# EAGLE design DimmerRGB_RevB (EAGLE 7.6.0)

## Sheet 1 of 2
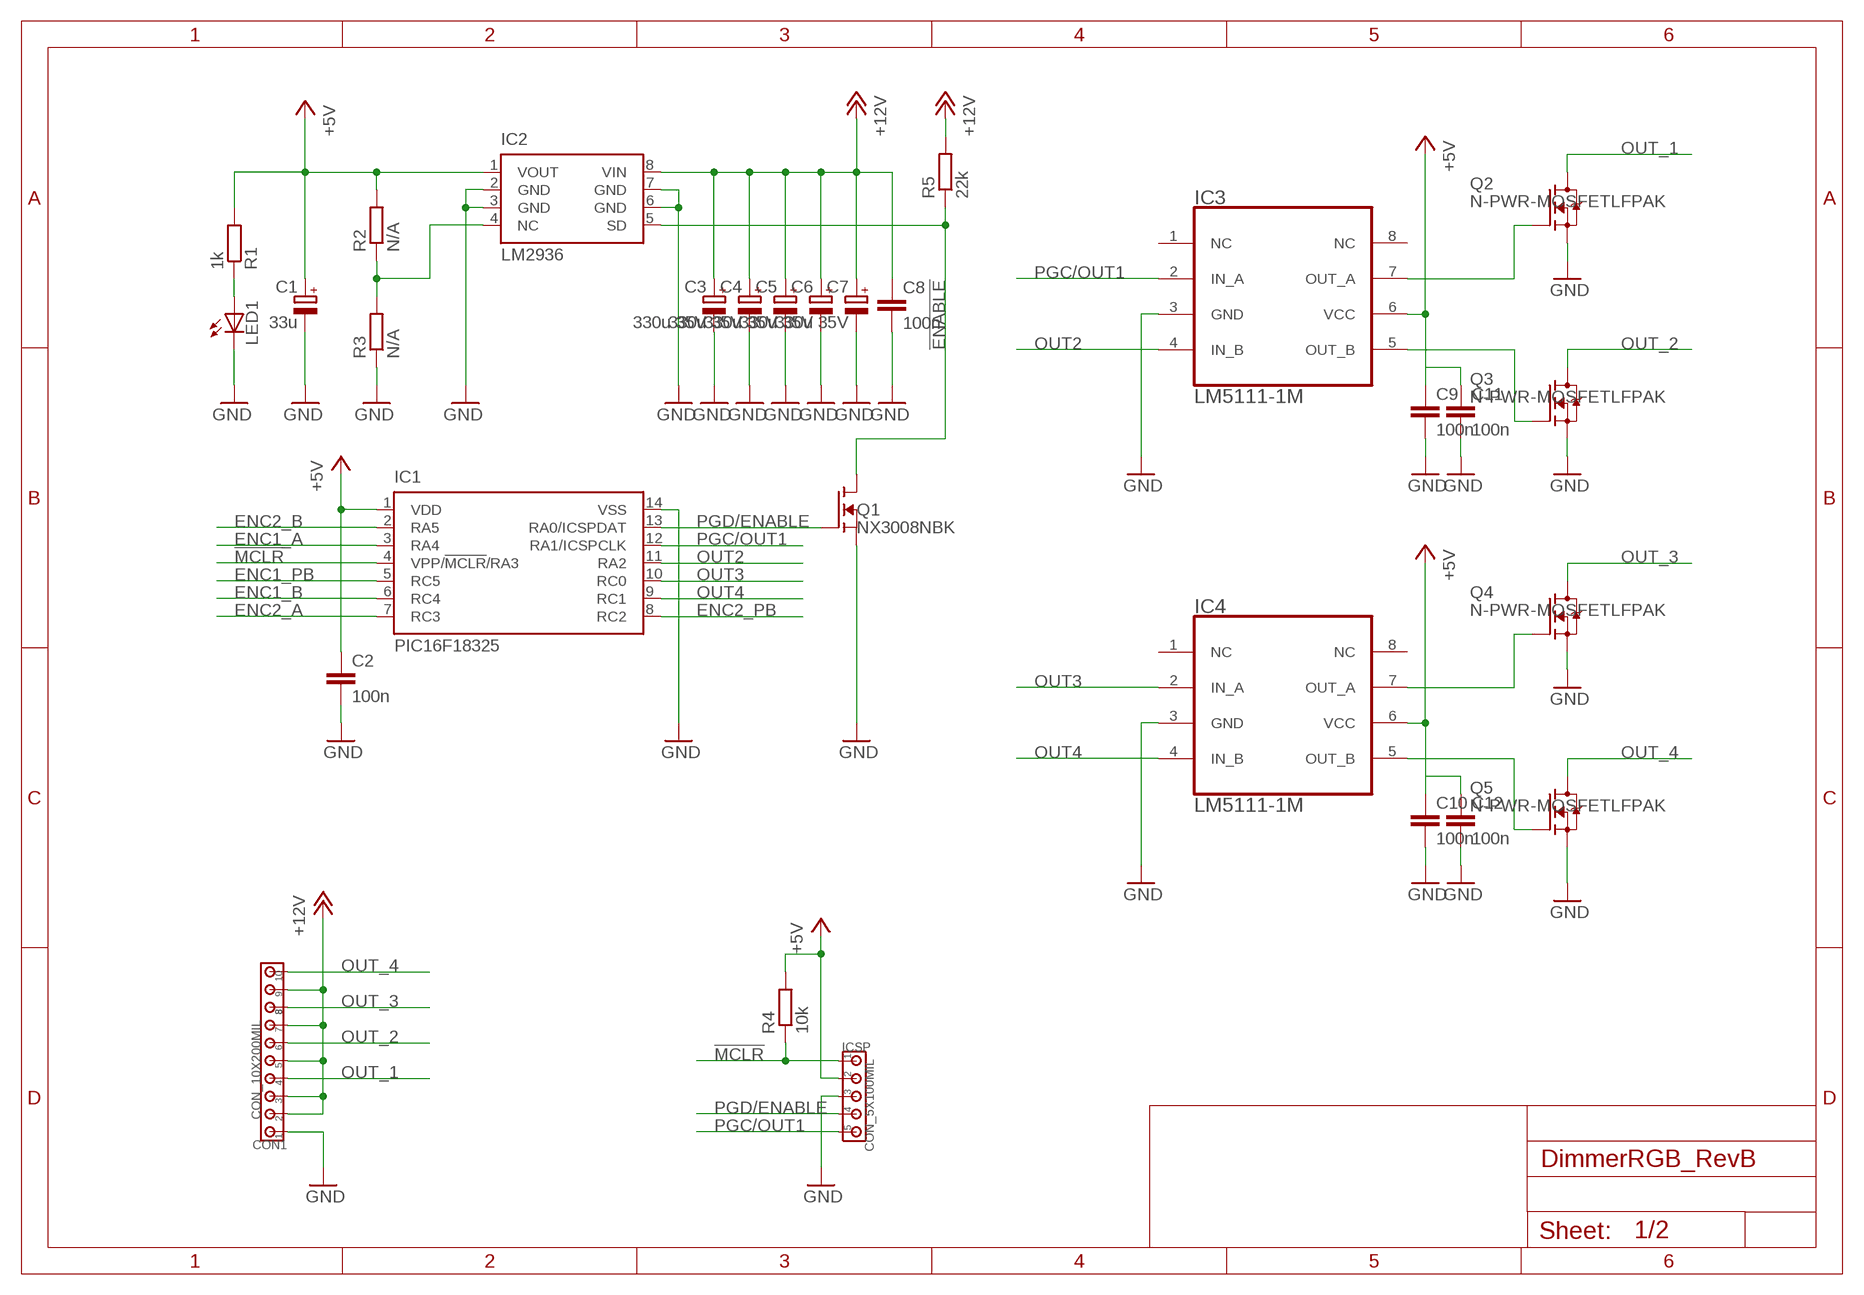
[diagram p0: schematic, sheet 1]

### Parts
C1  33u  C_POLARIZEDSMC_C  [SMC_C]
C2  100n  CC0805  [C0805]
C3  330u 35V  C_POLARIZED10MM  [10MM]
C4  330u 35V  C_POLARIZED10MM  [10MM]
C5  330u 35V  C_POLARIZED10MM  [10MM]
C6  330u 35V  C_POLARIZED10MM  [10MM]
C7  330u 35V  C_POLARIZED10MM  [10MM]
C8  100n  CC0805  [C0805]
C9  100n  CC0805  [C0805]
C10  100n  CC0805  [C0805]
C11  100n  CC0805  [C0805]
C12  100n  CC0805  [C0805]
CON1  CON_10X200MIL  [200MIL_10X]
IC1  PIC16F18325  [SO14]
IC2  LM2936  [SOIC8]
IC3  LM5111-1M  LM5111  [SOIC8]
IC4  LM5111-1M  LM5111  [SOIC8]
ICSP  CON_5X100MIL  [100MIL_5X]
LED1  LED0805  [LED0805]
Q1  NX3008NBK  N-FETSOT23  [SOT23]
Q2  N-PWR-MOSFETLFPAK  [LFPAK]
Q3  N-PWR-MOSFETLFPAK  [LFPAK]
Q4  N-PWR-MOSFETLFPAK  [LFPAK]
Q5  N-PWR-MOSFETLFPAK  [LFPAK]
R1  1k  RESISTORR0805  [R0805]
R2  N/A  RESISTORR0805  [R0805]
R3  N/A  RESISTORR0805  [R0805]
R4  10k  RESISTORR0805  [R0805]
R5  22k  RESISTORR0805  [R0805]

### Nets
!ENABLE!: IC2.5(SD) Q1.3(D) R5.1 ; also sheet 2
!MCLR!: IC1.4(VPP/!MCLR!/RA3) ICSP.1 R4.1
+5V: C1.+ C2.1 C9.1 C10.1 C11.1 C12.1 IC1.1(VDD) IC2.1(VOUT) IC3.6(VCC) IC4.6(VCC) ICSP.2 R1.2 R2.2 R4.2 ; also sheet 2
+12V: C3.+ C4.+ C5.+ C6.+ C7.+ C8.1 CON1.2 CON1.3 CON1.5 CON1.7 CON1.9 IC2.8(VIN) R5.2
ENC1_A: IC1.3(RA4) ; also sheet 2
ENC1_B: IC1.6(RC4) ; also sheet 2
ENC1_PB: IC1.5(RC5) ; also sheet 2
ENC2_A: IC1.7(RC3) ; also sheet 2
ENC2_B: IC1.2(RA5) ; also sheet 2
ENC2_PB: IC1.8(RC2) ; also sheet 2
GND: C1.- C2.2 C3.- C4.- C5.- C6.- C7.- C8.2 C9.2 C10.2 C11.2 C12.2 CON1.1 IC1.14(VSS) IC2.2(GND) IC2.3(GND) IC2.6(GND) IC2.7(GND) IC3.3(GND) IC4.3(GND) ICSP.3 LED1.C Q1.2(S) Q2.1(S) Q2.2(S) Q2.3(S) Q3.1(S) Q3.2(S) Q3.3(S) Q4.1(S) Q4.2(S) Q4.3(S) Q5.1(S) Q5.2(S) Q5.3(S) R3.1 ; also sheet 2
N$1: IC4.5(OUT_B) Q5.4(G)
N$2: LED1.A R1.1
N$5: IC3.7(OUT_A) Q2.4(G)
N$6: IC4.7(OUT_A) Q4.4(G)
N$8: IC2.4(NC) R2.1 R3.2
N$11: IC3.5(OUT_B) Q3.4(G)
OUT2: IC1.11(RA2) IC3.4(IN_B)
OUT3: IC1.10(RC0) IC4.2(IN_A)
OUT4: IC1.9(RC1) IC4.4(IN_B)
OUT_1: CON1.4 Q2.MB1(D) Q2.MB2(D) Q2.MB3(D) Q2.VIA1(D) Q2.VIA2(D) Q2.VIA3(D) Q2.VIA4(D) Q2.VIA5(D) Q2.VIA6(D) Q2.VIA7(D) Q2.VIA8(D) Q2.VIA9(D)
OUT_2: CON1.6 Q3.MB1(D) Q3.MB2(D) Q3.MB3(D) Q3.VIA1(D) Q3.VIA2(D) Q3.VIA3(D) Q3.VIA4(D) Q3.VIA5(D) Q3.VIA6(D) Q3.VIA7(D) Q3.VIA8(D) Q3.VIA9(D)
OUT_3: CON1.8 Q4.MB1(D) Q4.MB2(D) Q4.MB3(D) Q4.VIA1(D) Q4.VIA2(D) Q4.VIA3(D) Q4.VIA4(D) Q4.VIA5(D) Q4.VIA6(D) Q4.VIA7(D) Q4.VIA8(D) Q4.VIA9(D)
OUT_4: CON1.10 Q5.MB1(D) Q5.MB2(D) Q5.MB3(D) Q5.VIA1(D) Q5.VIA2(D) Q5.VIA3(D) Q5.VIA4(D) Q5.VIA5(D) Q5.VIA6(D) Q5.VIA7(D) Q5.VIA8(D) Q5.VIA9(D)
PGC/OUT1: IC1.12(RA1/ICSPCLK) IC3.2(IN_A) ICSP.5
PGD/ENABLE: IC1.13(RA0/ICSPDAT) ICSP.4 Q1.1(G)
Unconnected: IC3.1(NC) IC3.8(NC) IC4.1(NC) IC4.8(NC)

## Sheet 2 of 2
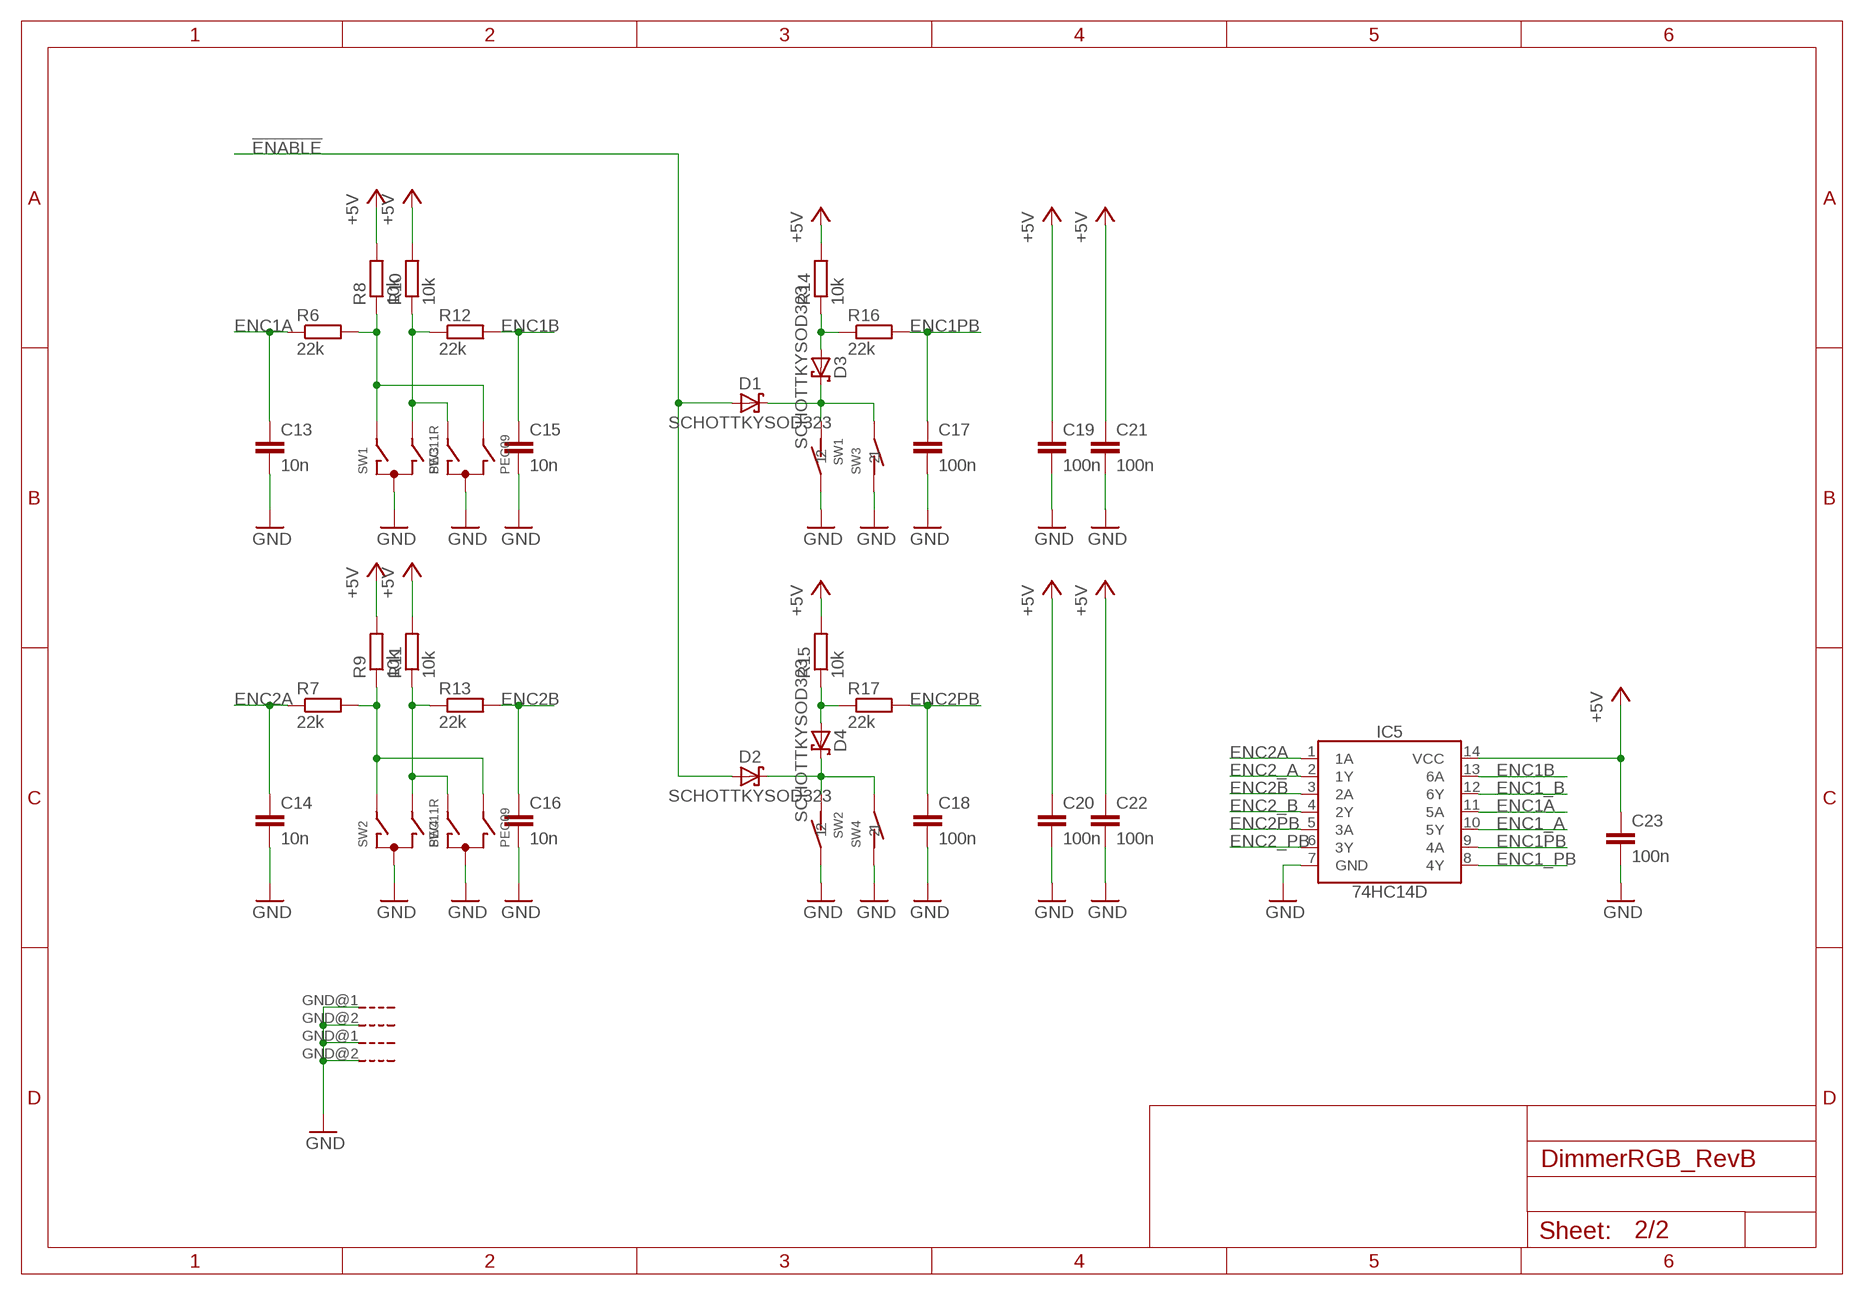
[diagram p1: schematic, sheet 2]

### Parts
C13  10n  CC0805  [C0805]
C14  10n  CC0805  [C0805]
C15  10n  CC0805  [C0805]
C16  10n  CC0805  [C0805]
C17  100n  CC0805  [C0805]
C18  100n  CC0805  [C0805]
C19  100n  CC0805  [C0805]
C20  100n  CC0805  [C0805]
C21  100n  CC0805  [C0805]
C22  100n  CC0805  [C0805]
C23  100n  CC0805  [C0805]
D1  SCHOTTKYSOD323  [SOD323]
D2  SCHOTTKYSOD323  [SOD323]
D3  SCHOTTKYSOD323  [SOD323]
D4  SCHOTTKYSOD323  [SOD323]
IC5  74HC14D  [SO14]
R6  22k  RESISTORR0805  [R0805]
R7  22k  RESISTORR0805  [R0805]
R8  10k  RESISTORR0805  [R0805]
R9  10k  RESISTORR0805  [R0805]
R10  10k  RESISTORR0805  [R0805]
R11  10k  RESISTORR0805  [R0805]
R12  22k  RESISTORR0805  [R0805]
R13  22k  RESISTORR0805  [R0805]
R14  10k  RESISTORR0805  [R0805]
R15  10k  RESISTORR0805  [R0805]
R16  22k  RESISTORR0805  [R0805]
R17  22k  RESISTORR0805  [R0805]
SW1  PEC11R  ENCODER_BOURNS  [ENCODER_BOURNS]
SW2  PEC11R  ENCODER_BOURNS  [ENCODER_BOURNS]
SW3  PEC09  [PEC09]
SW4  PEC09  [PEC09]

### Nets
!ENABLE!: D1.A D2.A ; also sheet 1
+5V: C19.1 C20.1 C21.1 C22.1 C23.1 IC5.14(VCC) R8.2 R9.2 R10.2 R11.2 R14.2 R15.2 ; also sheet 1
ENC1_A: IC5.10(5Y) ; also sheet 1
ENC1_B: IC5.12(6Y) ; also sheet 1
ENC1_PB: IC5.8(4Y) ; also sheet 1
ENC1A: C13.1 IC5.11(5A) R6.1
ENC1B: C15.1 IC5.13(6A) R12.2
ENC1PB: C17.1 IC5.9(4A) R16.2
ENC2_A: IC5.2(1Y) ; also sheet 1
ENC2_B: IC5.4(2Y) ; also sheet 1
ENC2_PB: IC5.6(3Y) ; also sheet 1
ENC2A: C14.1 IC5.1(1A) R7.1
ENC2B: C16.1 IC5.3(2A) R13.2
ENC2PB: C18.1 IC5.5(3A) R17.2
GND: C13.2 C14.2 C15.2 C16.2 C17.2 C18.2 C19.2 C20.2 C21.2 C22.2 C23.2 IC5.7(GND) SW1.2 SW1.C SW1.GND@1(G) SW1.GND@2(G) SW2.2 SW2.C SW2.GND@1(G) SW2.GND@2(G) SW3.C SW3.D SW4.C SW4.D ; also sheet 1
N$12: D2.C D4.C SW2.1 SW4.E
N$13: R10.1 R12.1 SW1.B SW3.A
N$14: R6.2 R8.1 SW1.A SW3.B
N$15: D3.A R14.1 R16.1
N$17: R7.2 R9.1 SW2.A SW4.B
N$18: D4.A R15.1 R17.1
N$19: D1.C D3.C SW1.1 SW3.E
N$20: R11.1 R13.1 SW2.B SW4.A

## Library data of the parts
C1 C3-C7 = 00Capacitor:C_POLARIZED
C2 C8-C23 = 00Capacitor:C: Capacitor
CON1 = 00Connector:CON_10X: 10-pin header
D1-D4 = 00Diode:SCHOTTKY
IC1 = 00PIC:PIC16F18325
IC2 = 00VoltageRegulator:LM2936: Ultra-Low Quiescent Current LDO Voltage Regulator
IC3 IC4 = 00Logic:LM5111: Dual 5A Compound Gate Driver
IC5 = 00Logic:74HC14: Hex Inverter Schmitt Trigger
ICSP = 00Connector:CON_5X: 5-pin header
LED1 = 00Display:LED: LED
Q1 = 00Mosfet:N-FET: N-Channel MOSFET
Q2-Q5 = 00Mosfet:N-PWR-MOSFET
R1-R17 = 00Resistor:RESISTOR: RESISTOR, European symbol
SW1 SW2 = 00Switch:ENCODER_BOURNS: Bourns Rotary Encoder with Switch PEC11-4xxxF-Sxxxx
SW3 SW4 = 00Switch:PEC09

## Board
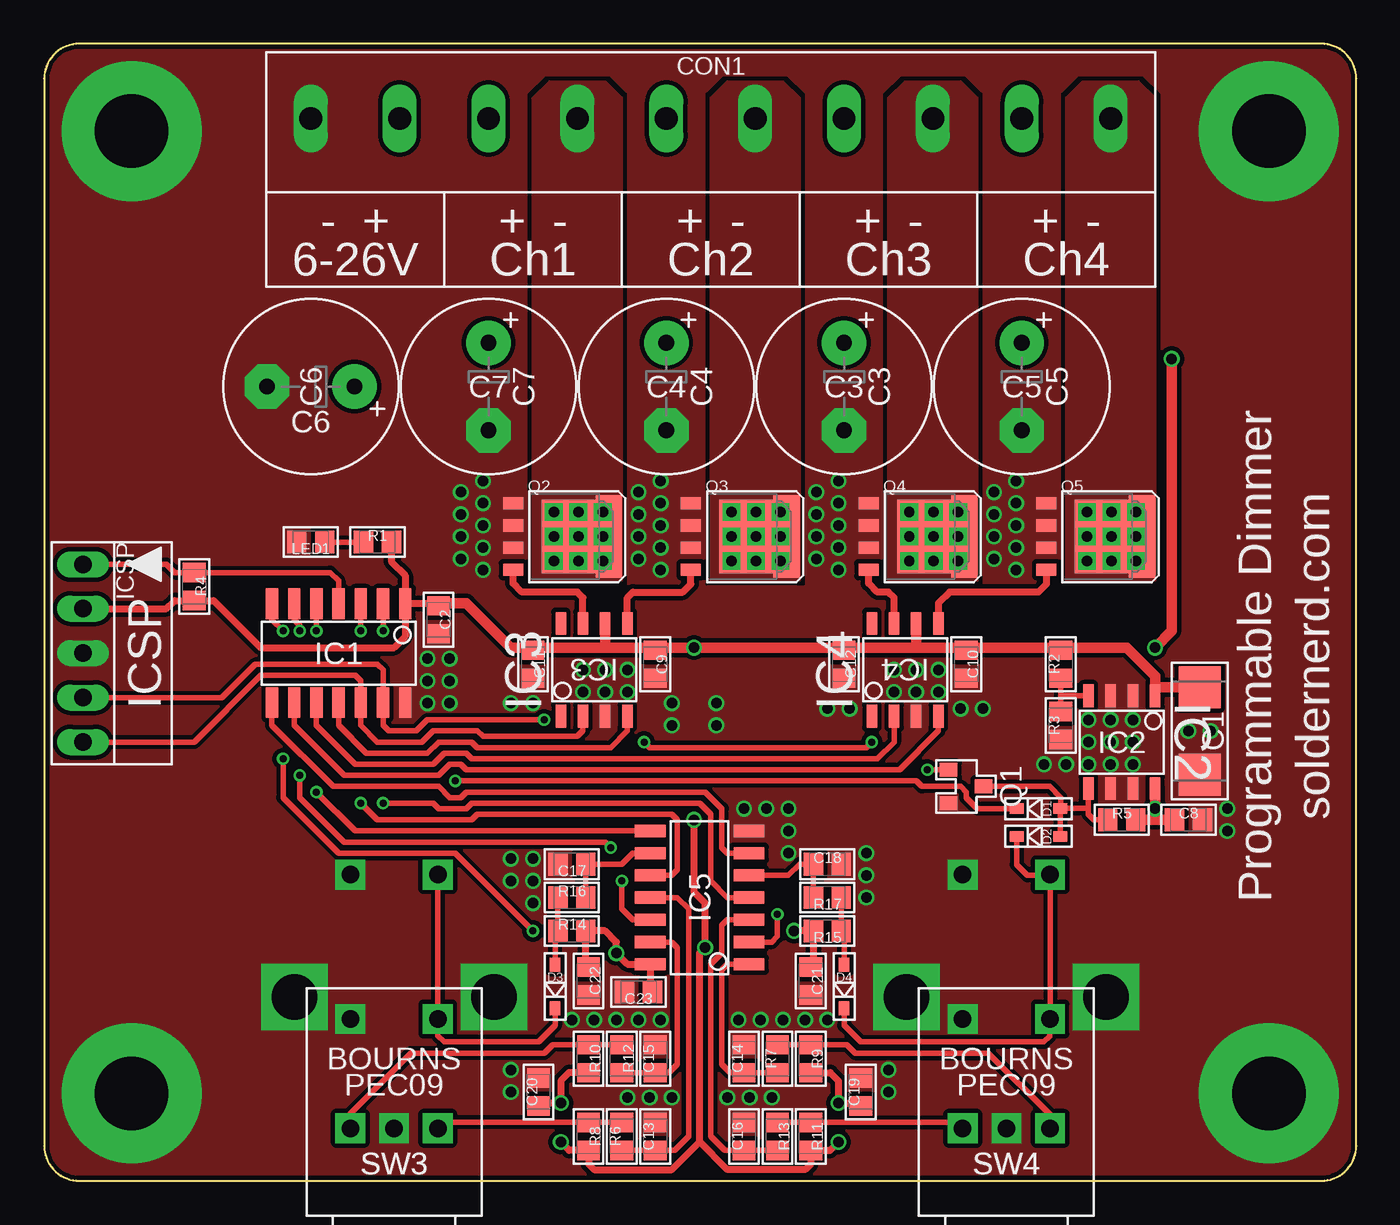
[diagram p2: board, top side]
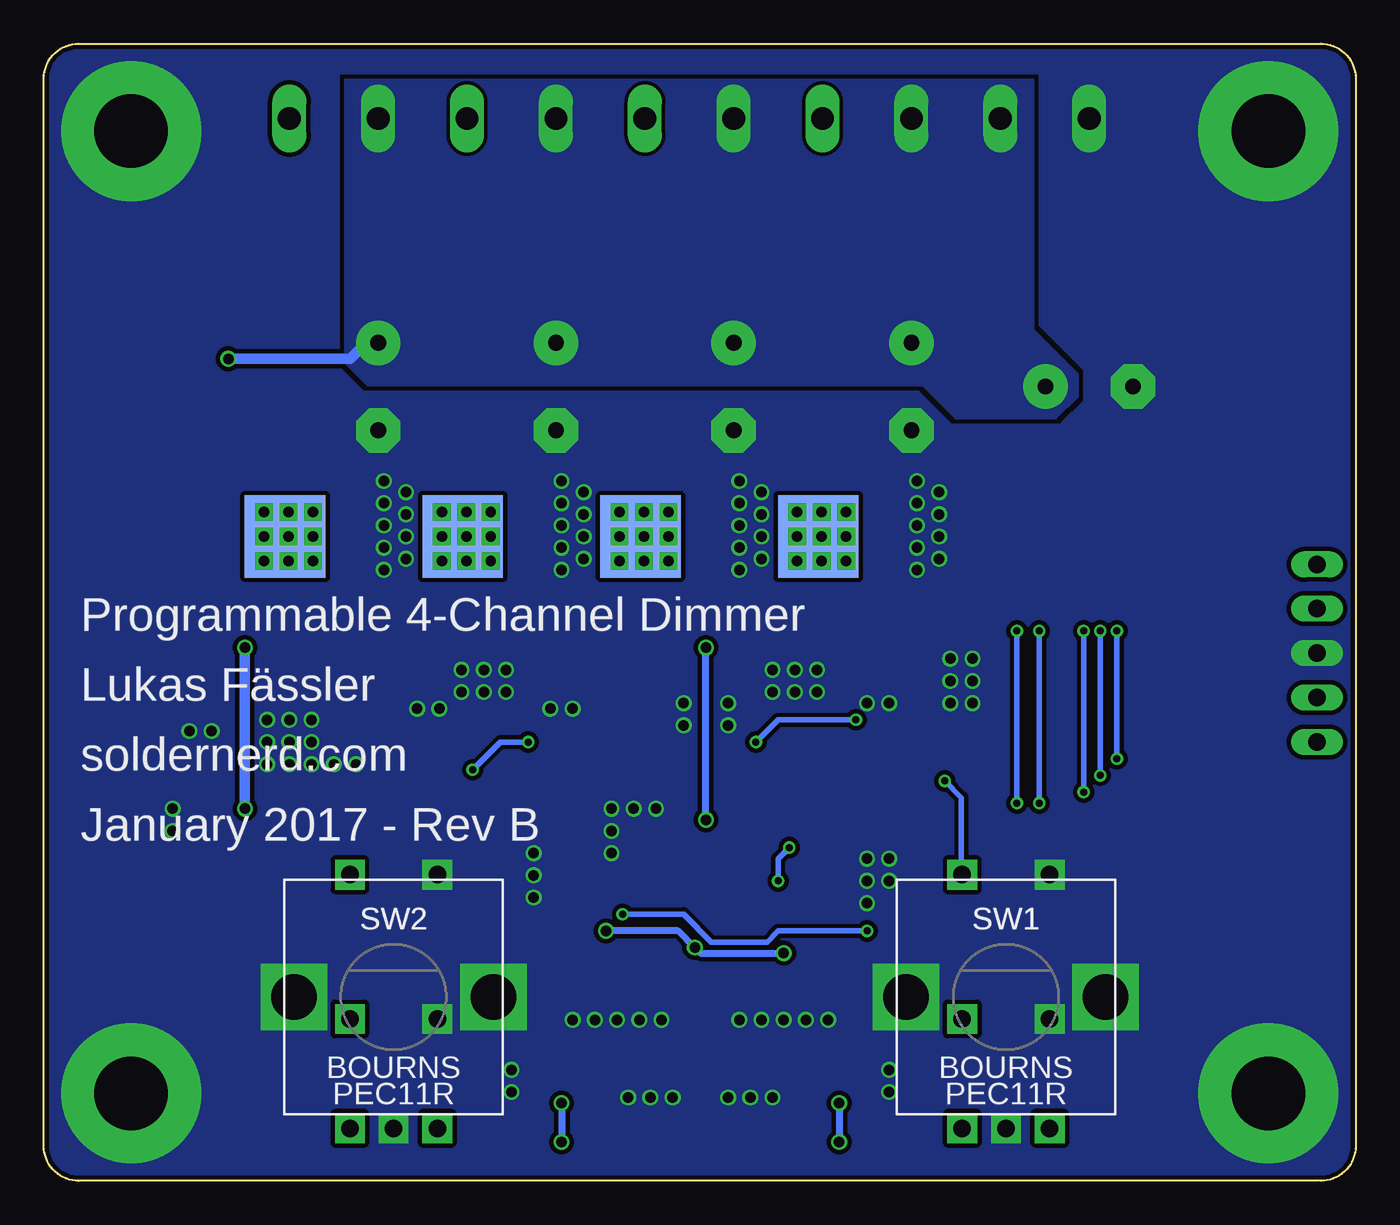
[diagram p3: board, bottom side, seen from below]

Size 75 x 65 mm. Coordinates in mm from the lower left corner, seen from the top.
Outline: 73,0 arc90 75,2 75,63 arc90 73,65 2,65 arc90 0,63 0,2 arc90 2,0 73,0
Copper layers (1*16): Top 0.035mm / dielectric 1.5mm / Bottom 0.035mm
Design rules "dirt_cheap_dirty_boards.8mil": minimum track width 5mil, minimum drill 12mil, track to track 8mil, track to pad 8mil, pad to pad 8mil, via to via 8mil, smd to smd 0mil, copper to edge 10mil, drill to drill 10mil, minimum pad ring 8mil, minimum via ring 6mil, stop-mask expansion 2mil, vias tented up to drill 25mil, thermal gap 10mil

### Footprints (pad centres in the part's own frame; a part is rotated, then mirrored left to right if it is on the bottom)
SMC_C = smd 2.4 x 2.4: + -2.5,0; - 2.5,0
C0805 = smd 1.1 x 1.3: 1 -0.8,0; 2 0.8,0
10MM = drill 0.9 pad 2.54: + -2.5,0 | drill 0.9 pad 2.54 octagon: - 2.5,0
200MIL_10X = drill 1.3 long: 1 -22.86,0; 2 -17.78,0; 3 -12.7,0; 4 -7.62,0; 5 -2.54,0; 6 2.54,0; 7 7.62,0; 8 12.7,0; 9 17.78,0; 10 22.86,0
SOD323 = smd 0.8 x 0.6: A 1.25,0; C -1.25,0
SO14 = smd 0.7 x 1.75: 1 -3.81,-2.825; 2 -2.54,-2.825; 3 -1.27,-2.825; 4 0,-2.825; 5 1.27,-2.825; 6 2.54,-2.825; 7 3.81,-2.825; 8 3.81,2.825; 9 2.54,2.825; 10 1.27,2.825; 11 0,2.825; 12 -1.27,2.825; 13 -2.54,2.825; 14 -3.81,2.825
SOIC8 = smd 1.3 x 0.6: 1 -2.65,1.905; 2 -2.65,0.635; 3 -2.65,-0.635; 4 -2.65,-1.905; 5 2.65,-1.905; 6 2.65,-0.635; 7 2.65,0.635; 8 2.65,1.905
100MIL_5X = drill 1 long: 1 -5.08,0; 2 -2.54,0; 3 0,0; 4 2.54,0; 5 5.08,0
LED0805 = smd 1.1 x 1.3: A -0.8,0; C 0.8,0
SOT23 = smd 0.8 x 1: 1 -0.95,-1; 2 0.95,-1; 3 0,1
LFPAK = smd 0.7 x 1.15: 1 -1.905,-2.725; 2 -0.635,-2.725; 3 0.635,-2.725; 4 1.905,-2.725 | smd 4.2 x 3.1: MB1 0,0.45 | smd 4.7 x 1.5: MB2 0,2.75 | smd 4.7 x 4.6 bottom: MB3 0,1.2 | drill 0.6 square: VIA1 -1.4,2.4; VIA2 0,2.4; VIA3 1.4,2.4; VIA4 -1.4,1; VIA5 0,1; VIA6 1.4,1; VIA7 -1.4,-0.4; VIA8 0,-0.4; VIA9 1.4,-0.4
R0805 = smd 1.1 x 1.3: 1 -0.8,0; 2 0.8,0
ENCODER_BOURNS = drill 1 pad 1.7 square: 1 -2.5,7; 2 2.5,7; A -2.5,-7.5; B 2.5,-7.5; C 0,-7.5 | drill 2.6 pad 3.8 square: GND@1 -5.7,0; GND@2 5.7,0
PEC09 = drill 1 pad 1.7 square: A -2.5,0; B 2.5,0; C 0,0; D -2.5,6.25; E 2.5,6.25

### Placement (x,y rotation side)
C1  66.04,25.72 270 top
C2  22.54,32.07 270 top
C3  45.72,45.4 270 top
C4  35.56,45.4 270 top
C5  55.88,45.4 270 top
C6  15.24,45.4 180 top
C7  25.4,45.4 270 top
C8  65.41,20.64 0 top
C9  34.92,29.53 270 top
C10  52.7,29.53 270 top
C11  27.94,29.53 270 top
C12  45.72,29.53 270 top
C13  34.92,2.54 90 top
C14  40.01,6.99 90 top
C15  34.92,6.99 90 top
C16  40.01,2.54 90 top
C17  30.16,18.1 180 top
C18  44.77,18.1 0 top
C19  46.67,5.08 90 top
C20  28.26,5.08 90 top
C21  43.81,11.43 270 top
C22  31.11,11.43 270 top
C23  33.97,10.79 180 top
CON1  38.1,60.72 0 top
D1  56.83,21.27 0 top
D2  56.83,19.68 0 top
D3  29.21,11.11 90 top
D4  45.72,11.11 90 top
IC1  16.83,30.16 180 top
IC2  61.59,25.08 270 top
IC3  31.43,29.21 90 top
IC4  49.21,29.21 90 top
IC5  37.47,16.19 90 top
ICSP  2.22,30.16 270 top
LED1  15.24,36.51 180 top
Q1  52.7,22.54 270 top
Q2  29.53,36.83 270 top
Q3  39.69,36.83 270 top
Q4  49.85,36.83 270 top
Q5  60.01,36.83 270 top
R1  19.05,36.51 0 top
R2  58.1,29.53 90 top
R3  58.1,26.04 90 top
R4  8.57,33.97 270 top
R5  61.59,20.64 0 top
R6  33.02,2.54 90 top
R7  41.91,6.99 90 top
R8  31.11,2.54 270 top
R9  43.81,6.99 270 top
R10  31.11,6.99 270 top
R11  43.81,2.54 270 top
R12  33.02,6.99 270 top
R13  41.91,2.54 270 top
R14  30.16,14.29 0 top
R15  44.77,14.29 180 top
R16  30.16,16.19 0 top
R17  44.77,16.19 180 top
SW1  20,10.5 0 bottom
SW2  55,10.5 0 bottom
SW3  20,3 0 top
SW4  55,3 0 top

### Tracks (layer width: path | path; a pad name or v marks a point on that pad's centre or on a via)
!ENABLE!
  Top 0.305: D2.A D1.A 58.1,21.29 | Q1.3 57.47,22.54 58.1,21.91 58.1,21.29 | R5.1 60.01,20.64 59.69,20.95 59.69,21.27 | 59.69,21.27 IC2.5 | 58.1,21.29 59.67,21.29 59.69,21.27
!MCLR!
  Top 0.305: ICSP.1 6.99,35.24 7.46,34.77 R4.1 16.34,34.77 16.83,34.29 IC1.4
+5V  (via drill 0.6)
  Top 0.305: 34.55,12.38 IC5.14
  Top 0.406: v45.4,2.22 44.92,1.74 R11.2 43.81,0.95 43.5,0.64 39.05,0.64 37.47,2.22 | R9.2 44.93,6.18 45.4,5.71 v45.4,4.45 46.51,4.45 C19.1 | 37.47,2.22 35.88,0.64 31.43,0.64 31.11,0.95 R8.2 30.01,1.74 v29.53,2.22 | R10.2 30,6.18 29.53,5.71 v29.53,4.45 28.42,4.45 C20.1 | 37.47,2.22 37.47,13.02 v37.78,13.34 37.78,15.88 37.15,16.51 v37.15,20.64 | ICSP.2 6.99,32.7 7.46,33.17 R4.2 9.69,33.17 12.38,30.48 20,30.48 20.64,31.11 IC1.1 | C2.1 22.42,32.99 IC1.1 | v42.86,14.29 R15.2 43.97,12.38 C21.1 | R1.2 19.85,35.4 20.64,34.61 IC1.1 | C22.1 30.96,12.38 R14.2 32.07,14.29 32.7,13.65 v32.7,13.02 33.34,12.38 IC5.14 34.64,10.93 C23.1 | C11.1 27.94,30.48 | C12.1 45.72,30.48
  Top 0.61: 66.04,28.26 C1.+ 63.54,28.22 63.5,28.26 | 52.86,30.48 58.1,30.48 | 52.86,30.48 49.85,30.48 | 49.85,30.48 45.72,30.48 v37.15,30.48 34.92,30.48 | 34.92,30.48 32.07,30.48 | 32.07,30.48 27.94,30.48 26.67,30.48 24.13,33.02 22.7,33.02 C2.1 | IC3.6 32.07,30.48 | C9.1 34.92,30.48 | IC4.6 49.85,30.48 | 52.86,30.48 C10.1 | IC2.1 63.5,28.26 | 63.5,28.26 63.5,28.85 61.87,30.48 58.1,30.48 | R2.2 58.1,30.48
  Bottom 0.406: v45.4,4.45 v45.4,2.22 | v29.53,4.45 v29.53,2.22 | v32.7,13.02 37.47,13.02 v37.78,13.34 38.73,14.29 v42.86,14.29 | v37.15,20.64 v37.15,30.48
+12V  (via drill 0.6)
  Top 0.61: IC2.8 v63.5,21.27 63.5,20.64 | 63.5,20.64 R5.2 | C8.1 63.5,20.64 | v64.45,46.99 64.45,31.43 v63.5,30.48
  Bottom 0.61: C5.+ 56.55,47.9 57.47,46.99 v64.45,46.99 | v63.5,30.48 v63.5,21.27
  pour Bottom (no thermals): 57.78,62.95 57.78,46.75 56.52,45.48 24.77,45.48 22.86,43.58 17.14,43.58 15.88,44.85 15.88,46.12 18.41,48.66 18.41,62.95
ENC1_A  (via drill 0.4)
  Top 0.305: IC5.10 35.88,17.46 36.2,17.78 36.2,20.64 35.88,20.95 24.77,20.95 24.45,20.64 19.05,20.64 v18.1,21.59 | IC1.3 v18.1,31.43
  Bottom 0.305: v18.1,31.43 v18.1,21.59
ENC1_B  (via drill 0.4)
  Top 0.305: IC5.12 33.66,14.92 33.02,15.56 v33.02,17.14 | IC1.6 14.29,32.07 14.61,31.75 v14.61,31.43 | v32.38,19.05 32.07,19.37 17.14,19.37 14.61,21.91 v14.61,23.18
  Bottom 0.305: v14.61,31.43 v14.61,23.18 | v33.02,17.14 33.02,18.41 v32.38,19.05
ENC1_PB  (via drill 0.4)
  Top 0.305: IC1.5 v15.56,31.43 | IC5.8 17.78,20 v15.56,22.23
  Bottom 0.305: v15.56,31.43 v15.56,22.23
ENC1A
  Top 0.305: R6.1 C13.1 36.03,1.74 36.83,2.54 36.83,15.56 36.2,16.19 IC5.11
ENC1B
  Top 0.305: R12.2 C15.1 35.71,6.18 36.2,6.67 36.2,13.34 35.88,13.65 IC5.13
ENC1PB
  Top 0.305: R16.2 C17.1 33.02,18.1 33.66,18.73 IC5.9
ENC2_A  (via drill 0.4)
  Top 0.305: IC1.7 13.02,32.07 v13.65,31.43 | IC5.2 41.59,13.65 41.91,13.97 v41.91,15.24 | v13.65,24.13 13.65,21.91 16.83,18.73 23.5,18.73 v27.94,14.29
  Bottom 0.305: v13.65,31.43 v13.65,24.13 | v41.91,15.24 38.42,15.24 36.83,13.65 33.66,13.65 33.02,14.29 v27.94,14.29
ENC2_B  (via drill 0.4)
  Top 0.305: IC5.4 39.05,16.19 38.1,17.14 38.1,20.95 37.47,21.59 24.45,21.59 24.13,21.27 22.54,21.27 22.23,21.59 v19.37,21.59 | IC1.2 v19.37,31.43
  Bottom 0.305: v19.37,31.43 v19.37,21.59
ENC2_PB
  Top 0.305: IC1.8 13.02,26.04 16.51,22.54 22.54,22.54 23.18,21.91 23.81,21.91 24.13,22.23 37.78,22.23 38.73,21.27 38.73,19.05 39.05,18.73 IC5.6
ENC2A
  Top 0.305: R7.1 C14.1 39.22,6.18 38.73,6.67 38.73,12.06 39.05,12.38 IC5.1
ENC2B
  Top 0.305: R13.2 C16.1 38.9,1.74 38.1,2.54 38.1,12.38 38.73,13.02 38.73,14.61 39.05,14.92 IC5.3
ENC2PB
  Top 0.305: R17.2 C18.1 43.18,18.1 42.55,17.46 IC5.5
GND  (via drill 0.6, 4.2 pad 8)
  other vias: 5,5 70,5 5,60 70,60 21.91,28.57 25.08,40.01 25.08,38.73 25.08,37.47 25.08,36.2 25.08,34.92 35.24,34.92 35.24,36.2 35.24,37.47 35.24,38.73 35.24,40.01 45.4,34.92 45.4,36.2 45.4,37.47 45.4,38.73 45.4,40.01 55.56,34.92 55.56,36.2 55.56,37.47 55.56,38.73 55.56,40.01 33.97,9.21 35.24,9.21 35.88,4.76 39.69,9.21 40.96,9.21 39.05,4.76 34.61,4.76 40.32,4.76 27.94,18.41 27.94,17.14 46.99,17.46 46.99,18.73 30.16,9.21 31.43,9.21 42.55,18.73 48.26,5.08 42.55,20 46.99,16.19 42.23,9.21 32.7,9.21 27.94,15.88 26.67,18.41 41.59,4.76 33.34,4.76 30.8,29.21 32.07,29.21 33.34,29.21 33.34,27.94 32.07,27.94 30.8,27.94 35.88,27.3 35.88,26.04 48.58,27.94 48.58,29.21 49.85,29.21 49.85,27.94 51.12,27.94 51.12,29.21 52.39,26.99 53.66,26.99 21.91,29.84 23.18,28.57 23.18,29.84 23.18,27.3 38.42,27.3 38.42,26.04 21.91,27.3 62.23,26.35 62.23,25.08 62.23,23.81 60.96,23.81 60.96,25.08 60.96,26.35 59.69,23.81 59.69,25.08 59.69,26.35 58.42,23.81 57.15,23.81 67.63,20 66.67,25.72 65.41,25.72 67.63,21.27 48.26,6.35 42.55,21.27 26.67,6.35 26.67,5.08 40.01,21.27 41.27,21.27 26.67,17.14 23.81,39.37 23.81,38.1 23.81,36.83 23.81,35.56 33.97,35.56 33.97,36.83 33.97,38.1 33.97,39.37 44.13,39.37 44.13,38.1 44.13,36.83 44.13,35.56 54.29,39.37 54.29,38.1 54.29,36.83 54.29,35.56 44.77,9.21 43.5,9.21 27.94,27.3 26.67,27.3 46.04,26.99 44.77,26.99
  pour Bottom (isolate 0.254, rank 3, no thermals): 73,0 2,0 arc-90 0,2 0,63 arc-90 2,65 73,65 arc-90 75,63 75,2 arc-90
  pour Top (isolate 0.254, rank 3, no thermals): 0,2 0,63 arc-90 2,65 73,65 arc-90 75,63 75,2 arc-90 73,0 2,0 arc-90
N$1
  Top 0.406: Q5.4 57.28,34.1 56.83,33.66 51.75,33.66 51.12,33.02 IC4.5
N$2
  Top 0.305: LED1.A R1.1
N$5
  Top 0.406: IC3.7 30.8,33.34 30.48,33.66 27.3,33.66 26.8,34.16 Q2.4
N$6
  Top 0.406: IC4.7 48.58,33.34 48.26,33.66 47.62,33.66 47.12,34.16 Q4.4
N$8
  Top 0.305: R2.1 58.1,27.62 | 58.1,27.62 R3.2 | IC2.4 58.21,27.73 58.1,27.62
N$11
  Top 0.406: IC3.5 33.34,33.34 33.66,33.66 36.51,33.66 36.96,34.1 Q3.4
N$12
  Top 0.305: D4.C 45.72,8.89 46.67,7.94 57.15,7.94 57.47,8.26 57.47,9.22 SW4.E SW2.1 57.46,17.46 56.2,17.46 55.58,18.08 D2.C
N$13
  Top 0.305: R12.1 R10.1 29.06,7.79 28.57,7.3 20.95,7.3 17.5,3.85 SW3.A
N$14
  Top 0.305: R6.2 R8.1 | 31.11,3.32 R8.1 | R8.1 22.84,3.34 SW3.B
N$15
  Top 0.305: R16.1 R14.1 29.21,14.13 D3.A
N$17
  Top 0.305: R7.2 R9.1 45.87,7.79 46.35,7.3 53.98,7.3 57.5,3.78 SW2.A
N$18
  Top 0.305: R17.1 R15.1 45.72,14.13 D4.A
N$19  (via drill 0.4)
  Top 0.305: SW1.1 SW3.E 22.5,8.3 22.86,7.94 28.26,7.94 29.21,8.89 D3.C | D1.C 53.34,21.27 52.7,21.91 52.7,22.23 52.39,22.54 50.16,22.54 49.85,22.86 v23.5,22.86
  Bottom 0.305: v23.5,22.86 22.54,21.91 22.54,17.54 SW1.1
N$20
  Top 0.305: R13.1 R11.1 | 43.81,3.32 R11.1 | R11.1 52.16,3.34 SW2.B
OUT2
  Top 0.305: IC3.4 33.34,25.72 32.38,24.77 24.77,24.77 24.45,25.08 22.54,25.08 21.91,24.45 18.41,24.45 16.83,26.04 IC1.11
OUT3
  Top 0.305: IC4.2 48.58,25.08 47.62,24.13 24.45,24.13 24.13,24.45 22.86,24.45 22.23,23.81 17.78,23.81 15.56,26.04 IC1.10
OUT4
  Top 0.305: IC4.4 51.12,25.72 48.9,23.5 24.13,23.5 23.81,23.81 23.18,23.81 22.54,23.18 17.14,23.18 14.29,26.04 IC1.9
OUT_1
  Bottom 0.305: Q2.MB3 Q2.VIA5
  pour Top (isolate 0.254, no thermals): 27.94,34.29 27.94,61.91 28.89,62.87 32.07,62.87 33.02,61.91 33.02,34.29
OUT_2
  Bottom 0.305: Q3.MB3 Q3.VIA5
  pour Top (isolate 0.254, no thermals): 39.05,62.87 42.23,62.87 43.18,61.91 43.18,34.29 38.1,34.29 38.1,61.91
OUT_3
  Bottom 0.305: Q4.MB3 Q4.VIA5
  pour Top (isolate 0.254, no thermals): 49.21,62.87 52.39,62.87 53.34,61.91 53.34,34.29 48.26,34.29 48.26,61.91
OUT_4
  Bottom 0.305: Q5.MB3 Q5.VIA5
  pour Top (isolate 0.254, no thermals): 59.37,62.87 62.55,62.87 63.5,61.91 63.5,34.29 58.42,34.29 58.42,61.91
PGC/OUT1
  Top 0.305: IC3.2 30.8,25.72 30.48,25.4 25.08,25.4 24.77,25.72 22.23,25.72 21.59,25.08 19.05,25.08 18.1,26.04 IC1.12 18.1,28.57 17.78,28.89 12.38,28.89 8.57,25.08 ICSP.5
PGD/ENABLE  (via drill 0.4)
  Top 0.305: v47.31,25.08 46.99,24.77 34.61,24.77 v34.29,25.08 | v28.57,26.35 21.91,26.35 21.27,25.72 19.68,25.72 19.37,26.04 IC1.13 19.37,29.21 19.05,29.53 12.06,29.53 10.16,27.62 ICSP.4 | 51.76,23.49 Q1.1 v50.48,23.49 v50.48,23.5
  Bottom 0.305: v34.29,25.08 33.02,26.35 v28.57,26.35 | v47.31,25.08 48.9,25.08 v50.48,23.5

### Text on the board
tPlace: - + | + - | + - | + - | + - | 6-26V | Ch1 | Ch2 | Ch3 | Ch4 | ICSP | Programmable Dimmer | soldernerd.com
bPlace: Programmable 4-Channel Dimmer | Lukas Fässler | soldernerd.com | January 2017 - Rev B